# EAGLE schematic differentGateFromLibrary (EAGLE 7.4.0)
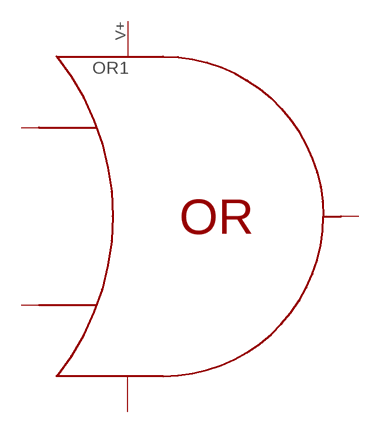
[diagram p0: schematic, sheet 1]

## Parts
OR1  OR  [OR]
Unconnected: OR1.A OR1.B OR1.OR OR1.V+ OR1.V-

## Library data of the parts
OR1 = p.peter-gator:OR